# EAGLE schematic Sensor schematic- 1 (EAGLE 9.6.1)
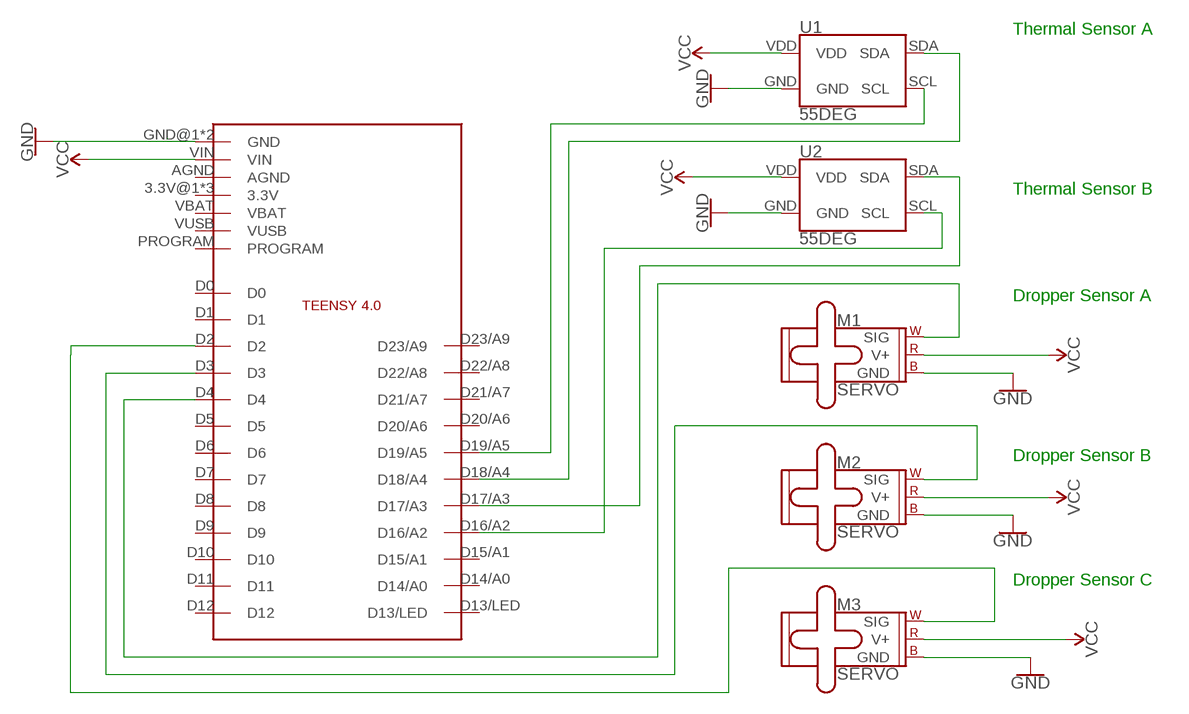
[diagram p0: schematic, sheet 1]

## Parts
M1  SERVO  [1X03]
M2  SERVO  [1X03]
M3  SERVO  [1X03]
U1  55DEG  MLX90540_MLX90640  [MLX90540_MLX90640]
U2  55DEG  MLX90540_MLX90640  [MLX90540_MLX90640]
U$1  TEENSY4.0  [TEENSY4.0]

## Nets
GND: M1.3(GND) M2.3(GND) M3.3(GND) U1.GND U2.GND U$1.GND@1(GND) U$1.GND@2(GND)
N$1: U2.SDA U$1.D17/A3
N$2: U$1.D19/A5
N$4: M1.1(SIG) U$1.D4
N$5: M2.1(SIG) U$1.D3
N$6: M3.1(SIG) U$1.D2
N$8: U1.SCL
N$9: U1.SDA U$1.D18/A4
N$11: U2.SCL U$1.D16/A2
VCC: M1.2(V+) M2.2(V+) M3.2(V+) U1.VDD U2.VDD U$1.VIN
Unconnected: U$1.3.3V@1(3.3V) U$1.3.3V@2(3.3V) U$1.AGND U$1.D0 U$1.D1 U$1.D5 U$1.D6 U$1.D7 U$1.D8 U$1.D9 U$1.D10 U$1.D11 U$1.D12 U$1.D13/LED U$1.D14/A0 U$1.D15/A1 U$1.D20/A6 U$1.D21/A7 U$1.D22/A8 U$1.D23/A9 U$1.ON/OFF(3.3V) U$1.PROGRAM U$1.VBAT U$1.VUSB

## Notes on the sheet
- Thermal Sensor A
- Thermal Sensor B
- Dropper Sensor A
- Dropper Sensor B
- Dropper Sensor C

## Library data of the parts
M1-M3 = SparkFun-Electromechanical:SERVO: Servo Motor 3-pin connector for a standard servo motor (voltage supply, ground, and control signal.) SparkFun Products Servo - Generic (Sub-Micro Size) <https://www.sparkfun.com/products/9065> (ROB-09065) Servo - Generic High Torque Continuous Rotation (Standard Size) <https://www.sparkfun.com/products/9347> (ROB-09347) Servo - Generic High Torque (Standard Size) <https://www.sparkfun.com/products/11965> (ROB-11965)
U1 U2 = SparkFun-IC-Special-Function:MLX90540_MLX90640: Melexis MLX90640 Infrared Array The MLX90640 is a fully calibrated 32x24 pixels thermal IR array in an industry standard 4-lead TO39 package with digital interface.; PROD_ID: IC-14042
U$1 = Teensy4.0:TEENSY4.0

## Module RESISTER
Ports: 

### Library data of the parts

## Module GND
Ports: 

### Library data of the parts